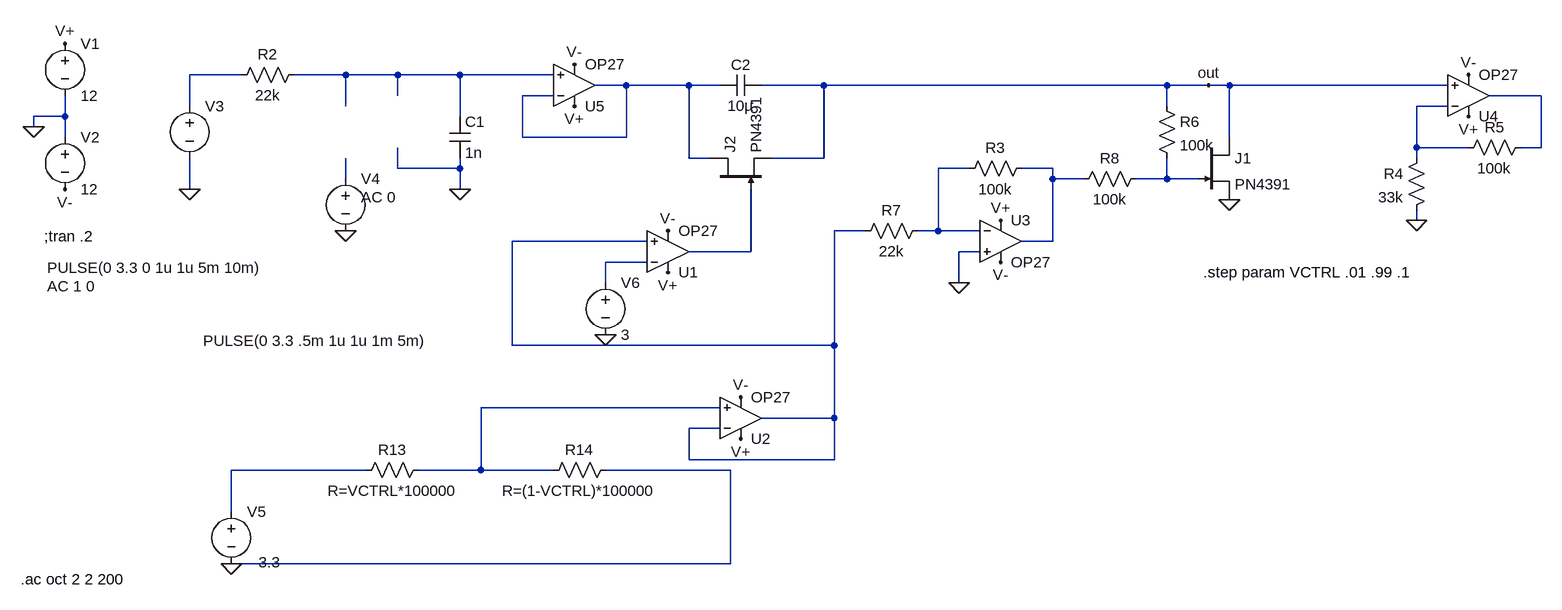
[diagram p0: schematic coupling_filter.asc]
coupling_filter.asc, the LTspice schematic file:
Version 4
SHEET 1 3480 1080
WIRE -208 288 -288 288
WIRE -48 288 -128 288
WIRE 32 288 -48 288
WIRE 128 288 32 288
WIRE 272 288 128 288
WIRE 384 304 336 304
WIRE 480 304 384 304
WIRE 528 304 480 304
WIRE 688 304 592 304
WIRE 1216 304 688 304
WIRE 1280 304 1216 304
WIRE 1312 304 1280 304
WIRE 1648 304 1312 304
WIRE 32 320 32 288
WIRE 272 320 224 320
WIRE 1792 320 1712 320
WIRE -288 336 -288 288
WIRE -48 336 -48 288
WIRE 1216 336 1216 304
WIRE 1648 336 1600 336
WIRE -480 352 -480 320
WIRE -480 352 -528 352
WIRE 128 352 128 288
WIRE -528 368 -528 352
WIRE -480 384 -480 352
WIRE 224 384 224 320
WIRE 384 384 384 304
WIRE 384 384 224 384
WIRE 1312 384 1312 304
WIRE 1600 400 1600 336
WIRE 1680 400 1600 400
WIRE 1792 400 1792 320
WIRE 1792 400 1760 400
WIRE 480 416 480 304
WIRE 512 416 480 416
WIRE 688 416 688 304
WIRE 688 416 608 416
WIRE 1600 416 1600 400
WIRE 32 432 32 400
WIRE 128 432 128 416
WIRE 128 432 32 432
WIRE 912 432 864 432
WIRE 1040 432 992 432
WIRE -48 448 -48 416
WIRE 1040 448 1040 432
WIRE 1088 448 1040 448
WIRE 1216 448 1216 416
WIRE 1216 448 1168 448
WIRE 1264 448 1216 448
WIRE -288 464 -288 416
WIRE 128 464 128 432
WIRE 1600 512 1600 496
WIRE 752 528 704 528
WIRE 864 528 864 432
WIRE 864 528 832 528
WIRE 928 528 864 528
WIRE 416 544 208 544
WIRE 1040 544 1040 448
WIRE 1040 544 992 544
WIRE 576 560 576 464
WIRE 576 560 480 560
WIRE 928 560 896 560
WIRE 416 576 352 576
WIRE 352 608 352 576
WIRE 896 608 896 560
WIRE 208 704 208 544
WIRE 704 704 704 528
WIRE 704 704 208 704
WIRE 528 800 160 800
WIRE 704 816 704 704
WIRE 704 816 592 816
WIRE 528 832 480 832
WIRE 480 880 480 832
WIRE 704 880 704 816
WIRE 704 880 480 880
WIRE -16 896 -224 896
WIRE 160 896 160 800
WIRE 160 896 64 896
WIRE 272 896 160 896
WIRE 544 896 352 896
WIRE -224 960 -224 896
WIRE 544 1040 544 896
WIRE 544 1040 -224 1040
FLAG -528 368 0
FLAG -480 240 V+
FLAG -480 464 V-
FLAG 304 272 V-
FLAG -288 464 0
FLAG -48 528 0
FLAG 128 464 0
FLAG 1680 352 V+
FLAG 1680 288 V-
FLAG 1600 512 0
FLAG -224 1040 0
FLAG 1312 480 0
FLAG 960 512 V+
FLAG 960 576 V-
FLAG 1280 304 out
FLAG 896 608 0
FLAG 448 528 V-
FLAG 352 688 0
FLAG 448 592 V+
FLAG 304 336 V+
FLAG 560 784 V-
FLAG 560 848 V+
SYMBOL voltage -480 224 R0
WINDOW 123 0 0 Left 0
WINDOW 39 0 0 Left 0
SYMATTR InstName V1
SYMATTR Value 12
SYMBOL voltage -480 368 R0
WINDOW 123 0 0 Left 0
WINDOW 39 0 0 Left 0
SYMATTR InstName V2
SYMATTR Value 12
SYMBOL voltage -288 320 R0
WINDOW 3 -219 265 Left 2
WINDOW 123 -219 293 Left 2
WINDOW 39 0 0 Left 0
SYMATTR Value PULSE(0 3.3 0 1u 1u 5m 10m)
SYMATTR Value2 AC 1 0
SYMATTR InstName V3
SYMBOL voltage -48 432 R0
WINDOW 3 -219 265 Left 2
WINDOW 123 24 44 Left 2
WINDOW 39 0 0 Left 0
SYMATTR Value PULSE(0 3.3 .5m 1u 1u 1m 5m)
SYMATTR Value2 AC 0
SYMATTR InstName V4
SYMBOL res -112 272 R90
WINDOW 0 0 56 VBottom 2
WINDOW 3 32 56 VTop 2
SYMATTR InstName R2
SYMATTR Value 22k
SYMBOL cap 112 352 R0
SYMATTR InstName C1
SYMATTR Value 1n
SYMBOL cap 592 288 R90
WINDOW 0 0 32 VBottom 2
WINDOW 3 32 32 VTop 2
SYMATTR InstName C2
SYMATTR Value 10µ
SYMBOL res 1616 400 M0
SYMATTR InstName R4
SYMATTR Value 33k
SYMBOL res 1776 384 R90
WINDOW 0 0 56 VBottom 2
WINDOW 3 32 56 VTop 2
SYMATTR InstName R5
SYMATTR Value 100k
SYMBOL voltage -224 944 R0
WINDOW 3 42 94 Left 2
WINDOW 123 0 0 Left 0
WINDOW 39 0 0 Left 0
SYMATTR Value 3.3
SYMATTR InstName V5
SYMBOL res 1008 416 R90
WINDOW 0 0 56 VBottom 2
WINDOW 3 32 56 VTop 2
SYMATTR InstName R3
SYMATTR Value 100k
SYMBOL res 848 512 R90
WINDOW 0 0 56 VBottom 2
WINDOW 3 32 56 VTop 2
SYMATTR InstName R7
SYMATTR Value 22k
SYMBOL njf 1264 384 R0
SYMATTR InstName J1
SYMATTR Value PN4391
SYMBOL res 1072 464 R270
WINDOW 0 32 56 VTop 2
WINDOW 3 0 56 VBottom 2
SYMATTR InstName R8
SYMATTR Value 100k
SYMBOL res 1200 320 R0
SYMATTR InstName R6
SYMATTR Value 100k
SYMBOL njf 512 464 R270
SYMATTR InstName J2
SYMATTR Value PN4391
SYMBOL voltage 352 592 R0
WINDOW 123 0 0 Left 0
WINDOW 39 0 0 Left 0
SYMATTR InstName V6
SYMATTR Value 3
SYMBOL res 80 880 R90
WINDOW 0 0 56 VBottom 2
WINDOW 3 32 56 VTop 2
SYMATTR InstName R13
SYMATTR Value R=VCTRL*100000
SYMBOL res 368 880 R90
WINDOW 0 0 56 VBottom 2
WINDOW 3 32 56 VTop 2
SYMATTR InstName R14
SYMATTR Value R=(1-VCTRL)*100000
SYMBOL Opamps\\OP27 304 368 M180
SYMATTR InstName U5
SYMBOL Opamps\\OP27 448 624 M180
SYMATTR InstName U1
SYMBOL Opamps\\OP27 560 880 M180
SYMATTR InstName U2
SYMBOL Opamps\\OP27 960 480 R0
SYMATTR InstName U3
SYMBOL Opamps\\OP27 1680 384 M180
SYMATTR InstName U4
TEXT -512 536 Left 2 !;tran .2
TEXT 1272 592 Left 2 !.step param VCTRL .01 .99 .1
TEXT -548 1064 Left 2 !.ac oct 2 2 200

The netlist it stands for:
* coupling_filter.asc
V1 V+ 0 12
V2 0 V- 12
V3 N001 0 PULSE(0 3.3 0 1u 1u 5m 10m) AC 1 0
V4 N008 0 PULSE(0 3.3 .5m 1u 1u 1m 5m) AC 0
R2 N002 N001 22k
C1 N002 0 1n
C2 out N003 10µ
R4 N005 0 33k
R5 N004 N005 100k
V5 N014 0 3.3
R3 N007 N006 100k
R7 N006 N010 22k
J1 out N009 0 PN4391
R8 N007 N009 100k
R6 out N009 100k
J2 N003 N011 out PN4391
V6 N012 0 3
R13 N013 N014 R=VCTRL*100000
R14 0 N013 R=(1-VCTRL)*100000
XU5 N002 N003 V+ V- N003 OP27  ; pins In+ In- V+ V- OUT
XU1 N010 N012 V+ V- N011 OP27  ; pins In+ In- V+ V- OUT
XU2 N013 N010 V+ V- N010 OP27  ; pins In+ In- V+ V- OUT
XU3 0 N006 V+ V- N007 OP27  ; pins In+ In- V+ V- OUT
XU4 out N005 V+ V- N004 OP27  ; pins In+ In- V+ V- OUT
.model NJF NJF
.model PJF PJF
.lib standard.jft
;tran .2
.step param VCTRL .01 .99 .1
.ac oct 2 2 200
.lib ADI.lib
.backanno
.end